# Altium schematic sheet current_channel.SchDoc: Current Channel
size A3; DrawnBy: Stefan Lippuner; Organization: TIK; DocumentNumber: 5; Revision: 1.1; SheetNumber: 5; SheetTotal: 8; PageSetup: Record=PageOptions|CenterHorizontal=True|CenterVertical=True|PrintScale=1.00|XCorrection=1.00|YCorrection=1.00|PrintKind=1|BorderSize=5000000|LeftOffset=0|BottomOffset=0|Orientation=2|PaperLength=1000|PaperWidth=1000|Scale=100|PaperSource=7|PrintQuality=-3|MediaType=1|DitherType=10|PrintScaleMode=1|PaperKind=A3|PaperIndex=8
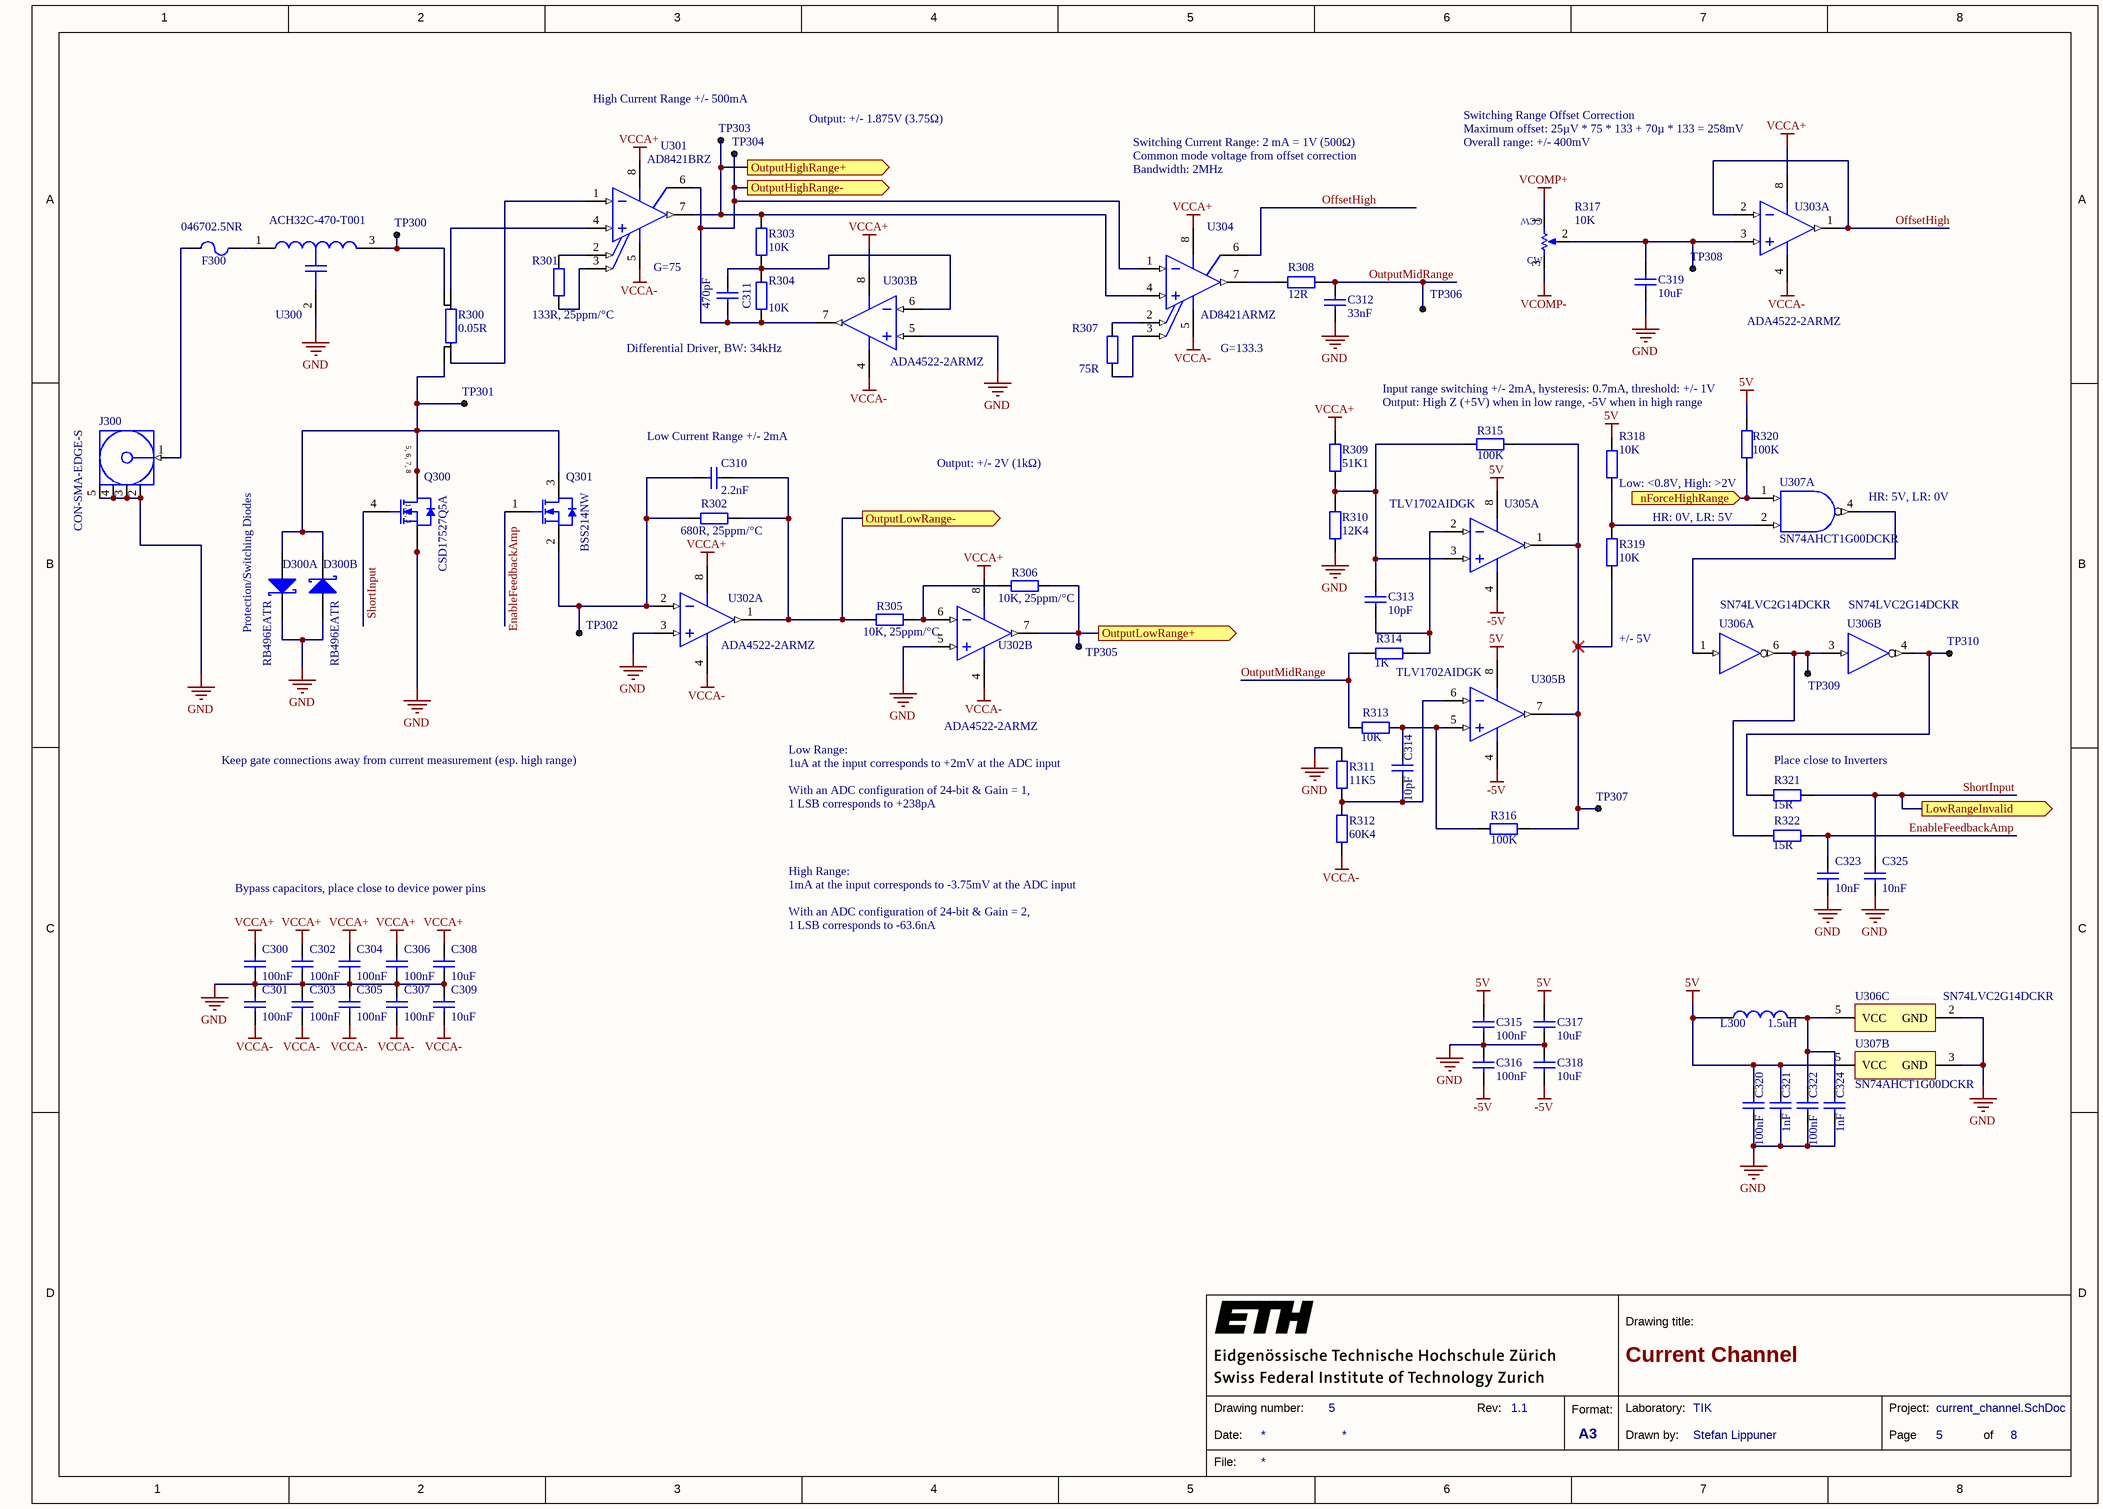
[diagram p0: current_channel.SchDoc]

## Parts
(Parts that share a designator on the sheet are numbered #1, #2 ... from top to bottom, then left to right.)
C300  100nF  [CAPC0402(1005)60_L]
C301  100nF  [CAPC0402(1005)60_L]
C302  100nF  [CAPC0402(1005)60_L]
C303  100nF  [CAPC0402(1005)60_L]
C304  100nF  [CAPC0402(1005)60_L]
C305  100nF  [CAPC0402(1005)60_L]
C306  100nF  [CAPC0402(1005)60_L]
C307  100nF  [CAPC0402(1005)60_L]
C308  10uF  [CAPC0603(1608)100_L]
C309  10uF  [CAPC0603(1608)100_L]
C310  2.2nF  [CAPC0402(1005)60_L]
C311  470pF  [CAPC0402(1005)60_L]
C312  33nF  [CAPC0402(1005)60_L]
C313  10pF  [CAPC0402(1005)60_L]
C314  10pF  [CAPC0402(1005)60_L]
C315  100nF  [CAPC0402(1005)60_L]
C316  100nF  [CAPC0402(1005)60_L]
C317  10uF  [CAPC0603(1608)100_L]
C318  10uF  [CAPC0603(1608)100_L]
C319  10uF  [CAPC0603(1608)100_L]
C320  100nF  [CAPC0402(1005)60_L]
C321  1nF  [CAPC0402(1005)60_L]
C322  100nF  [CAPC0402(1005)60_L]
C323  10nF  [CAPC0402(1005)60_L]
C324  1nF  [CAPC0402(1005)60_L]
C325  10nF  [CAPC0402(1005)60_L]
D300  RB496EATR  [Z5+1_L]  (parts A,B of 2)
F300  046702.5NR  [RESC0603(1608)_L]
J300  CON-SMA-EDGE-S  [132322]
L300  1.5uH  [INDC0603(1608)_L]
Q300  CSD17527Q5A  [PowerPAK_SO-8_V]
Q301  BSS214NW  [INF-PG-SOT-323_L]
R300  value 0.05R  [WSK1206]  (hidden comment: WSK1206R0500FEA)
R301  133R, 25ppm/°C  [RESC0402(1005)_L]
R302  680R, 25ppm/°C  [RESC0402(1005)_L]
R303  10K  [RESC0402(1005)_L]
R304  10K  [RESC0402(1005)_L]
R305  10K, 25ppm/°C  [RESC0402(1005)_L]
R306  10K, 25ppm/°C  [RESC0402(1005)_L]
R307  75R  [RESC0402(1005)_L]
R308  12R  [RESC0402(1005)_L]
R309  51K1  [RESC0402(1005)_L]
R310  12K4  [RESC0402(1005)_L]
R311  11K5  [RESC0402(1005)_L]
R312  60K4  [RESC0402(1005)_L]
R313  10K  [RESC0402(1005)_L]
R314  1K  [RESC0402(1005)_L]
R315  100K  [RESC0402(1005)_L]
R316  100K  [RESC0402(1005)_L]
R317  value 10K  [43W]  (hidden comment: 43WR10KLFTR)
R318  10K  [RESC0402(1005)_L]
R319  10K  [RESC0402(1005)_L]
R320  100K  [RESC0402(1005)_L]
R321  15R  [RESC0402(1005)_L]
R322  15R  [RESC0402(1005)_L]
TP300  (no value)  [Pad-0.6mm]  (no BOM)
TP301  (no value)  [Pad-0.6mm]  (no BOM)
TP302  (no value)  [Pad-0.6mm]  (no BOM)
TP303  (no value)  [Pad-0.6mm]  (no BOM)
TP304  (no value)  [Pad-0.6mm]  (no BOM)
TP305  (no value)  [Pad-0.6mm]  (no BOM)
TP306  (no value)  [Pad-0.6mm]  (no BOM)
TP307  (no value)  [Pad-0.6mm]  (no BOM)
TP308  (no value)  [Pad-0.6mm]  (no BOM)
TP309  (no value)  [Pad-0.6mm]  (no BOM)
TP310  (no value)  [Pad-0.6mm]  (no BOM)
U300  ACH32C-470-T001  [ACH32C]
U301  AD8421BRZ  [M08A_L]
U302#1  ADA4522-2ARMZ  [ADI-RM-8_L]  (part A of 2)
U302#2  ADA4522-2ARMZ  [ADI-RM-8_L]  (part B of 2)
U303  ADA4522-2ARMZ  [ADI-RM-8_L]  (parts A,B of 2)
U304  AD8421ARMZ  [ADI-RM-8_L]
U305  TLV1702AIDGK  [ADI-RM-8_L]  (parts A,B of 2)
U306  SN74LVC2G14DCKR  [DCK0006A_L]  (parts A,B,C of 3)
U307  SN74AHCT1G00DCKR  [DCK0005A_L]  (parts A,B of 2)

## Ports
LowRangeInvalid (out), nForceHighRange (in), OutputHighRange+ (out), OutputHighRange- (out), OutputLowRange+ (out), OutputLowRange- (out)

## Nets
5V: C315.2 C317.2 C320.2 C321.2 L300.1 R318.2 R320.2 U305.8(V+) U307.5(VCC)
-5V: C316.1 C318.1 U305.4(V-)
GND: C300.1 C301.2 C302.1 C303.2 C304.1 C305.2 C306.1 C307.2 C308.1 C309.2 C312.1 C315.1 C316.2 C317.1 C318.2 C319.1 C320.1 C321.1 C322.1 C323.1 C324.1 C325.1 D300.3(A) D300.5(K) J300.2(GND) J300.3(GND) J300.4(GND) J300.5(GND) Q300.1(S) Q300.2(S) Q300.3(S) R310.1 R311.2 U300.2 U302#1.3(1IN+) U302#2.5(2IN+) U303.5(2IN+) U306.2(GND) U307.3(GND)
VCCA+: C300.2 C302.2 C304.2 C306.2 C308.2 R309.2 U301.8(+VS) U302#1.8(V+) U302#2.8(V+) U303.8(V+) U304.8(+VS)
VCCA-: C301.1 C303.1 C305.1 C307.1 C309.1 R312.1 U301.5(-VS) U302#1.4(V-) U302#2.4(V-) U303.4(V-) U304.5(-VS)
VCOMP+: R317.1(CCW)
VCOMP-: R317.3(CW)
EnableFeedbackAmp: C323.2 Q301.1(GATE) R322.1
nForceHighRange: R320.1 U307.1(A) ; port nForceHighRange
OffsetHigh: U303.1(1OUT) U303.2(1IN-) U304.6(REF)
OutputHighRange+: R303.2 TP303.1 U301.7(VOUT) U304.4(+IN) ; port OutputHighRange+
OutputHighRange-: C311.1 R304.1 TP304.1 U301.6(REF) U303.7(2OUT) U304.1(-IN) ; port OutputHighRange-
OutputLowRange+: R306.1 TP305.1 U302#2.7(2OUT) ; port OutputLowRange+
OutputLowRange-: C310.2 R302.1 R305.2 U302#1.1(1OUT) ; port OutputLowRange-
OutputMidRange: C312.2 R308.2 R313.2 R314.1 TP306.1
ShortInput: C325.2 Q300.4(G) R321.1 ; port LowRangeInvalid
NetC310_1: C310.1 Q301.2(SOURCE) R302.2 TP302.1 U302#1.2(1IN-)
NetC311_2: C311.2 R303.1 R304.2 U303.6(2IN-)
NetC313_1: C313.1 R309.1 R310.2 R315.1 U305.3(1IN+)
NetC313_2: C313.2 R314.2 U305.2(1IN-)
NetC314_1: C314.1 R313.1 R316.1 U305.5(2IN+)
NetC314_2: C314.2 R311.1 R312.2 U305.6(2IN-)
NetC319_2: C319.2 R317.2(WIPER) TP308.1 U303.3(1IN+)
NetC322_2: C322.2 C324.2 L300.2 U306.5(VCC)
NetD300_1: D300.1(A) D300.4(K) Q300.5(D) Q300.6(D) Q300.7(D) Q300.8(D) Q301.3(DRAIN) R300.3(SENSE_1) TP301.1
NetF300_1: F300.1 J300.1(Signal)
NetF300_2: F300.2 U300.1
NetR300_1: R300.1 U301.1(-IN)
NetR300_2: R300.2 U301.4(+IN)
NetR300_4: R300.4(SENSE_2) TP300.1 U300.3
NetR301_1: R301.1 U301.3(RG3)
NetR301_2: R301.2 U301.2(RG2)
NetR305_1: R305.1 R306.2 U302#2.6(2IN-)
NetR307_1: R307.1 U304.3(RG3)
NetR307_2: R307.2 U304.2(RG2)
NetR308_1: R308.1 U304.7(VOUT)
NetR315_2: R315.2 R316.2 R319.1 TP307.1 U305.1(1OUT) U305.7(2OUT)
NetR318_1: R318.1 R319.2 U307.2(B)
NetR321_2: R321.2 TP310.1 U306.4(2Y)
NetR322_2: R322.2 TP309.1 U306.3(2A) U306.6(1Y)
NetU306_1: U306.1(1A) U307.4(Y)

## Notes on the sheet
- High Current Range +/- 500mA
- Output: +/- 1.875V (3.75Ω)
- Switching Current Range: 2 mA = 1V (500Ω)
  Common mode voltage from offset correction
  Bandwidth: 2MHz
- (near U303) Switching Range Offset Correction
  Maximum offset: 25µV * 75 * 133 + 70µ * 133 = 258mV
  Overall range: +/- 400mV
- (near U301) G=75
- Differential Driver, BW: 34kHz
- (near U304) G=133.3
- (near C310) Low Current Range +/- 2mA
- Input range switching +/- 2mA, hysteresis: 0.7mA, threshold: +/- 1V
- Output: High Z (+5V) when in low range, -5V when in high range
- Output: +/- 2V (1kΩ)
- (near R318) Low: <0.8V, High: >2V
- (near U307) HR: 5V, LR: 0V
- HR: 0V, LR: 5V
- (near D300) Protection/Switching Diodes
- +/- 5V
- Keep gate connections away from current measurement (esp. high range)
- (near R321) Place close to Inverters
- Low Range:
  1uA at the input corresponds to +2mV at the ADC input
  With an ADC configuration of 24-bit & Gain = 1,
  1 LSB corresponds to +238pA
- Bypass capacitors, place close to device power pins
- High Range:
  1mA at the input corresponds to -3.75mV at the ADC input
  With an ADC configuration of 24-bit & Gain = 2,
  1 LSB corresponds to -63.6nA
- 1
- 2
- 3
- 4
- 5
- 6
- 7
- 8
- A
- B
- C
- D
- Drawing title:
- Date:
- Drawing number:
- Rev:
- Format:
- A3
- Drawn by:
- Laboratory:
- Page
- Project:
- of
- File:
- (in symbol CMP-00221-1) 5, 6, 7, 8; 1, 2, 3

## Library data of the parts
C300-C307 C315 C316 C320 C322 = CMP-1034-02071-1: CAP 100nF 16V -20% to +80% 0402 (1005 Metric) Thickness 0.6mm SMD; Case-Metric: 1005; Case-EIA: 0402; Value: 100nF; Rated Voltage: 16 V; Tolerance: -20% to +80%; Technology: SMT; Max Thickness: 0.6 mm
C308 C309 C317-C319 = CMP-1035-02800-1: CAP 10uF 10V ±20% 0603 (1608 Metric) Thickness 1mm SMD; Tolerance: Â±20%; Case-EIA: 0603; Case-Metric: 1608; Max Thickness: 1 mm; Rated Voltage: 10 V; Technology: SMT; Value: 10uF
C310 = CMP-1034-01741-1: CAP 2.2nF 50V ±5% 0402 (1005 Metric) Thickness 0.6mm SMD; Case-EIA: 0402; Tolerance: Â±5%; Case-Metric: 1005; Technology: SMT; Value: 2.2nF; Max Thickness: 0.6 mm; Rated Voltage: 50 V
C311 = CMP-1034-01500-1: CAP 470pF 50V ±5% 0402 (1005 Metric) Thickness 0.6mm SMD; Case-Metric: 1005; Case-EIA: 0402; Tolerance: Â±5%; Max Thickness: 0.6 mm; Technology: SMT; Value: 470pF; Rated Voltage: 50 V
C312 = CMP-1590-00004-1: CAP 33nF 16V ±5%, 0402 (1005 Metric) Chip Capacitor; Case-EIA: 0402; Value: 30nF; Case-Metric: 1005; PackageReference: CAPC0402(1005)60; Supplier 1: Digi-Key; Supplier Part Number 1: 399-8964-6-ND
C313 C314 = CMP-1034-00724-1: CAP 10pF 50V ±5% 0402 (1005 Metric) Thickness 0.6mm SMD; Tolerance: Â±5%; Case-EIA: 0402; Case-Metric: 1005; Technology: SMT; Rated Voltage: 50 V; Value: 10pF; Max Thickness: 0.6 mm
C321 C324 = CMP-1034-01626-1: CAP 1nF 50V ±5% 0402 (1005 Metric) Thickness 0.6mm SMD; Case-EIA: 0402; Tolerance: Â±5%; Case-Metric: 1005; Rated Voltage: 50 V; Value: 1nF; Technology: SMT; Max Thickness: 0.6 mm
C323 C325 = CMP-1034-01879-1: CAP 10nF 25V ±5% 0402 (1005 Metric) Thickness 0.6mm SMD; Tolerance: Â±5%; Case-EIA: 0402; Case-Metric: 1005; Value: 10nF; Technology: SMT; Max Thickness: 0.6 mm; Rated Voltage: 25 V
D300 = CMP-00093-1: DIODE ARRAY SCHOTTKY 20V TSMD5; Manufacturer: Rohm Semiconductor; Diode Configuration: 2 Independent; Current - Average Rectified (Io) (per Diode): 1A; Voltage - Forward (Vf) (Max) @ If: 400mV @ 1A; Speed: Fast Recovery =< 500ns, > 200mA (Io); Current - Reverse Leakage @ Vr: 500µA @ 10V; Packaging: Digi-Reel®; Diode Type: Schottky; Voltage - DC Reverse (Vr) (Max): 20V; Mounting Type: Surface Mount; Package / Case: SOT-23-5 Thin, TSOT-23-5; Supplier Device Package: TSMD5; P/N: RB496EATR; Supplier: Digi-Key; Supplier Part Number: RB496EADKR-ND; ComponentLink1Description: rb496ea.pdf; ComponentLink1URL: http://rohmfs.rohm.com/en/products/databook/datasheet/discrete/diode/schottky_barrier/rb496ea.pdf
F300 = CMP-00099-1: Fuse Chip Very Fast Acting 2.5A 32V SMD Solder Pad 0603; Manufacturer: Littelfuse Inc.; Fuse Type: Board Mount (Cartridge Style Excluded); Breaking Capacity @ Rated Voltage: 35A; Melting I²t: 0.2066; Approvals: CSA, UL; DC Cold Resistance: 0.021 Ohm; Packaging: Tape & Reel (TR); Current Rating: 2.5A; Voltage Rating - AC: 32V; Voltage Rating - DC: 32V; Response Time: Fast; Package / Case: 0603 (1608 Metric); Mounting Type: Surface Mount; Operating Temperature: -55°C ~ 90°C; Color: -; Size / Dimension: 0.063" L x 0.032" W x 0.012" H (1.60mm x 0.81mm x 0.31mm); P/N: 046702.5NR; Supplier: Digi-Key; Supplier Part Number: F1398TR-ND; ComponentLink1Description: littelfuse_fuse_467_datasheet.pdf.pdf; ComponentLink1URL: http://www.littelfuse.com/~/media/electronics/datasheets/fuses/littelfuse_fuse_467_datasheet.pdf.pdf
J300 = CMP-00231-1: SMA FEMALE PCB EDGE MOUNT; Manufacturer: RF Solutions; Connector Type: Jack, Female Socket; Contact Termination: Solder; Packaging: -; Part Status: Active; Connector Style: SMA; Shield Termination: Solder; Impedance: -; Mounting Type: Board Edge, End Launch; Cable Group: -; Fastening Type: Threaded; Frequency - Max: -; Features: -; Housing Color: -; Ingress Protection: -; Body Material: -; Body Finish: -; Center Contact Material: -; Center Contact Plating: -; Dielectric Material: -; Voltage Rating: -; Operating Temperature: -; Manufacturer Part Number: CON-SMA-EDGE-S; Supplier: Digi-Key; Supplier Part Number: CON-SMA-EDGE-S-ND
L300 = CMP-00229-1: FIXED IND 1.5UH 50MA 700 MOHM; Manufacturer: TDK Corporation; Manufacturer Part Number: MLF1608A1R5M; Type: Multilayer; Material - Core: Ferrite; Inductance: 1.5µH; Tolerance: ±20%; Shielding: Shielded; DC Resistance (DCR): 700 mOhm Max; Q @ Freq: 35 @ 10MHz; Frequency - Self Resonant: 100MHz; Frequency - Test: 10MHz; Packaging: Cut Tape (CT); Part Status: Active; Current Rating: 50mA; Current - Saturation: -; Ratings: -; Operating Temperature: -40°C ~ 85°C; Mounting Type: Surface Mount; Package / Case: 0603 (1608 Metric); Size / Dimension: 0.063" L x 0.031" W (1.60mm x 0.80mm); Height - Seated (Max): 0.037" (0.95mm); Supplier: Digi-Key; Supplier Part Number: 445-6221-1-ND; ComponentLink1Description: inductor_commercial_standard_mlf1608_en.pdf; ComponentLink1URL: https://product.tdk.com/info/en/catalog/datasheets/inductor_commercial_standard_mlf1608_en.pdf
Q300 = CMP-00221-1: MOSFET N-CH 30V 65A 8SON; Manufacturer: Texas Instruments; FET Type: MOSFET N-Channel, Metal Oxide; FET Feature: Standard; Current - Continuous Drain (Id) @ 25°C: 65A (Tc); Rds On (Max) @ Id, Vgs: 10.8 mOhm @ 11A, 10V; Vgs(th) (Max) @ Id: 2V @ 250µA; Gate Charge (Qg) @ Vgs: 3.4nC @ 4.5V; Input Capacitance (Ciss) @ Vds: 506pF @ 15V; Power - Max: 3W; Packaging: Cut Tape (CT); Part Status: Active; Drain to Source Voltage (Vdss): 30V; Operating Temperature: -55°C ~ 150°C (TJ); Mounting Type: Surface Mount; Package / Case: 8-PowerTDFN; Supplier Device Package: 8-VSON (5x6); Manufacturer Part Number: CSD17527Q5A; Supplier: Digi-Key; Supplier Part Number: 296-29021-1-ND; ComponentLink1Description: csd17527q5a.pdf; ComponentLink1URL: http://www.ti.com/lit/ds/symlink/csd17527q5a.pdf
Q301 = CMP-1149-00041-1: N-Channel OptiMOS 2 Small-Signal-Transistor, 20 V VDS, 1.5 A ID, -55 to 150 degC, PG-SOT-323, Reel, Green; Manufacturer: Infineon; VDS (max): 20 V; VGS(th) (max): 1.2Â V; RthJA (max): 250 K/W; QG: 0.8Â nC; RDS (on) (max) (@4.5V): 140 mOhm; VGS(th) (min): 0.7Â V; IDpuls (max): 6 A; ID (max): 1.5Â A; Ptot (max): 0.5Â W; RDS (on) (max): 250 mOhm; Green: TRUE; PackageDescription: 3-Pin Small Outline Transistor Package, 2 x 1.25 mm Body, 0.65 mm Pitch; ComponentLink3URL: http://www.infineon.com/dgdl/SOT323-Package_Overview.pdf?folderId=db3a30431936bc4b0119533e1dcb3c92&fileId=db3a30431936bc4b011953495f283cb1; DatasheetVersion: Rev. 2.2; Mounting Technology: Surface Mount; ComponentLink2URL: http://www.infineon.com/dgdl/BSS214NW_Rev2.2.pdf?folderId=db3a3043156fd573011622e10b5c1f67&fileId=db3a30431b3e89eb011b695aebc01bde; PackageVersion: Apr-08; Halogen-free: TRUE; Packing: Reel; ComponentLink3Description: Package Specification; PartNumber: BSS214NW; ComponentLink2Description: Datasheet; PackageReference: PG-SOT-323; ComponentLink1URL: http://www.infineon.com/; RDS (on) (max) (@2.5V): 250 mOhm; ComponentLink1Description: Manufacturer URL
R300 = CMP-00094-1: RES SMD 0.05 OHM 1% 1/4W 1206; Manufacturer: Vishay Dale; Resistance (Ohms): 0.05; Power (Watts): 0.25W, 1/4W; Temperature Coefficient: ±35ppm/°C; Packaging: Cut Tape (CT); Tolerance: ±1%; Composition: Metal Element; Features: Current Sense, Moisture Resistant, Pulse Withstanding; Operating Temperature: -65°C ~ 170°C; Package / Case: 1206 (3216 Metric), Concave; Supplier Device Package: 1206; Size / Dimension: 0.126" L x 0.063" W (3.20mm x 1.60mm); Height: 0.035" (0.89mm); Number of Terminations: 2; Manufacturer Part Number: WSK1206R0500FEA; Supplier: Digi-Key; Supplier Part Number: 541-2707-1-ND; ComponentLink1Description: wsk1206.pdf; ComponentLink1URL: http://www.vishay.com/docs/30195/wsk1206.pdf
R301 = CMP-1591-00004-1: 133R, 25ppm/°C, 0402 (1005 Metric) Chip Resistor; Case-Metric: 1005; Case-EIA: 0402; PackageReference: RESC0402(1005); Supplier 1: Digi-Key; Supplier Part Number 1: A102612DKR-ND
R302 = CMP-1591-00004-1: 680R, 25ppm/°C 0402 (1005 Metric) Chip Resistor; Case-EIA: 0402; Case-Metric: 1005; PackageReference: RESC0402(1005); Supplier 1: Digi-Key; Supplier Part Number 1: RR05P680DCT-ND
R303 R304 R313 R318 R319 = CMP-1011-00623-1: 10K 0.063W 1% 0402 (1005 Metric)  SMD; Case-Metric: 1005; Value: 10000.00 Ohm; Case-EIA: 0402; Tolerance: 1 %; Technology: SMT; Power: 0.063 W
R305 R306 = CMP-1591-00004-1: 10K, 25ppm/°C 0402 (1005 Metric) Chip Resistor; Case-Metric: 1005; Case-EIA: 0402; PackageReference: RESC0402(1005); Supplier 1: Digi-Key; Supplier Part Number 1: RR05P10.0KDDKR-ND
R307 = CMP-1011-00383-1: 75R 0.063W 1% 0402 (1005 Metric)  SMD; Case-Metric: 1005; Case-EIA: 0402; Value: 75.00 Ohm; Power: 0.063 W; Tolerance: 1 %; Technology: SMT
R308 = CMP-1011-00001-1: 12R 0.063W 1% 0402 (1005 Metric)  SMD; Tolerance: None; Case-Metric: 1005; Case-EIA: 0402; Power: None; Value: 12R; Technology: SMT; Supplier 1: Digi-Key; Supplier Part Number 1: YAG2968DKR-ND
R309 = CMP-1011-00704-1: 51K1 0.063W 1% 0402 (1005 Metric)  SMD; Case-EIA: 0402; Case-Metric: 1005; Value: 51100.00 Ohm; Power: 0.063 W; Tolerance: 1 %; Technology: SMT
R310 = CMP-1011-00633-1: 12K4 0.063W 1% 0402 (1005 Metric)  SMD; Value: 12400.00 Ohm; Case-Metric: 1005; Case-EIA: 0402; Tolerance: 1 %; Power: 0.063 W; Technology: SMT
R311 = CMP-1011-00629-1: 11K5 0.063W 1% 0402 (1005 Metric)  SMD; Case-EIA: 0402; Case-Metric: 1005; Value: 11500.00 Ohm; Power: 0.063 W; Technology: SMT; Tolerance: 1 %
R312 = CMP-1011-00711-1: 60K4 0.063W 1% 0402 (1005 Metric)  SMD; Case-EIA: 0402; Case-Metric: 1005; Value: 60400.00 Ohm; Technology: SMT; Tolerance: 1 %; Power: 0.063 W
R314 = CMP-1011-00510-1: 1K 0.063W 1% 0402 (1005 Metric)  SMD; Case-EIA: 0402; Value: 1000.00 Ohm; Case-Metric: 1005; Technology: SMT; Tolerance: 1 %; Power: 0.063 W
R315 R316 R320 = CMP-1011-00736-1: 100K 0.063W 1% 0402 (1005 Metric)  SMD; Case-Metric: 1005; Value: 100000.00 Ohm; Case-EIA: 0402; Tolerance: 1 %; Technology: SMT; Power: 0.063 W
R317 = CMP-00121-2: TRIMMER 10K OHM 0.125W SMD; Manufacturer: TT Electronics/BI; Power (Watts): 0.125W, 1/8W; Tolerance: ±20%; Temperature Coefficient: ±100ppm/°C; Number of Turns: 11; Adjustment Type: Top Adjustment; Resistive Material: Cermet; Packaging: Tape & Reel (TR); Resistance (Ohms): 10k; Mounting Type: Surface Mount; Termination Style: J Lead; Size / Dimension: Rectangular - 0.161" x 0.125" Face x 0.161" H (4.10mm x 3.18mm x 4.10mm); P/N: 43WR10KLFTR; Supplier: Digi-Key; Supplier Part Number: 987-1030-2-ND; ComponentLink1Description: 43.pdf; ComponentLink1URL: http://www.bitechnologies.com/pdfs/43.pdf
R321 R322 = CMP-1011-00302-1: 15R 0.063W 1% 0402 (1005 Metric)  SMD; Case-Metric: 1005; Case-EIA: 0402; Value: 15.00 Ohm; Tolerance: 1 %; Power: 0.063 W; Technology: SMT
TP300-TP310 = CMP-00224-1: 0.6mm SMT Test Pad; Mounting Technology: SMT
U300 = CMP-00228-1: LC (T-Type) EMI Filter 3rd Order Low Pass 1 Channel C = 47pF 6A 1206 (3216 Metric), 3 PC Pad; Manufacturer: TDK Corporation; Number of Channels: 1; Attenuation Value: -15dB @ 650MHz ~ 2.5GHz; Resistance - Channel (Ohms): 0.002; Values: C = 47pF; ESD Protection: No; Voltage - Rated: 50V; Packaging: Tape & Reel (TR); Part Status: Active; Type: Low Pass; Filter Order: 3rd; Technology: LC (T-Type); Center / Cutoff Frequency: -; Current: 6A; Operating Temperature: -40°C ~ 125°C; Applications: General Purpose; Mounting Type: Surface Mount; Package / Case: 1206 (3216 Metric), 3 PC Pad; Size / Dimension: 0.126" L x 0.063" W (3.20mm x 1.60mm); Height: 0.091" (2.30mm); Manufacturer Part Number: ACH32C-470-T001; Supplier: Digi-Key; Supplier Part Number: 445-2991-2-ND; ComponentLink1Description: 3tf_commercial_power_ach32c_en.pdf; ComponentLink1URL: https://product.tdk.com/info/en/catalog/datasheets/3tf_commercial_power_ach32c_en.pdf
U301 = CMP-00086-1: Instrumentation Amplifier 3nV/Hz Low Power; Manufacturer: Analog Devices Inc.; Brand: Analog Devices; Number of Channels: 1 Channel; CMRR - Common Mode Rejection Ratio: 140 dB; Gain V/V: 1 V/V to 10000 V/V; Ib - Input Bias Current: 6 nA; Maximum Input Resistance: 30 GOhms at +/- 15 V; Operating Supply Current: 2 mA; PSRR - Power Supply Rejection Ratio: 150 dB; SR - Slew Rate: 35 V/us; Supply Voltage - Max: 36 V; Supply Voltage - Min: 5 V; Vcm - Common Mode Voltage: 5 V to 36 V; Voltage Gain dB: 80 dB; Vos - Input Offset Voltage: 25 uV; Amplifier Type: Instrumentation Amplifier; Package / Case: SOIC-8; Packaging: Tube; Product: Operational Amplifiers; Series: AD8421; Mounting Style: SMD/SMT; Maximum Operating Temperature: + 85 C; Minimum Operating Temperature: - 40 C; Standard Pack Qty: 98; RoHS - Mouser: Y; Minimum Order Quantity: 1; Reeling: False; P/N: AD8421BRZ; Supplier: Mouser; Supplier Part Number: 584-AD8421BRZ; ComponentLink1Description: AD8421-249267.pdf; ComponentLink1URL: http://www.mouser.com/ds/2/609/AD8421-249267.pdf
U302#1 U302#2 U303 = CMP-00103-1: SP Amp Zero Drift Amplifier Dual R-R I/O ±27.5V/55V 8-Pin MSOP; Manufacturer: Analog Devices Inc.; Amplifier Type: Zero-Drift; Output Type: Rail-to-Rail; Slew Rate: 1.7 V/µs; Gain Bandwidth Product: 2.7MHz; Current - Input Bias: 50pA; Voltage - Input Offset: 1.5µV; Current - Supply: 830µA; Current - Output / Channel: 32mA; Voltage - Supply, Single/Dual (±): 4.5 V ~ 55 V, ±2.25 V ~ 27.5 V; Packaging: Tube; Number of Circuits: -; -3db Bandwidth: -; Operating Temperature: -40°C ~ 125°C; Mounting Type: Surface Mount; Package / Case: 8-TSSOP, 8-MSOP (0.118", 3.00mm Width); Supplier Device Package: 8-MSOP; Manufacturer Part Number: ADA4522-2ARMZ; Supplier: Digi-Key; Supplier Part Number: ADA4522-2ARMZ-ND; ComponentLink1Description: ADA4522-1_4522-2_4522-4.pdf; ComponentLink1URL: http://www.analog.com/media/en/technical-documentation/data-sheets/ADA4522-1_4522-2_4522-4.pdf
U304 = CMP-00122-1: Instrument Amplifier, 1, 60 V, 35 V/ s, 10 MHz, 5V to 36V, MSOP; Manufacturer: Analog Devices Inc.; Amplifier Type: Instrumentation; Number of Circuits: 1; Slew Rate: 35 V/µs; -3db Bandwidth: 10MHz; Current - Input Bias: 1nA; Voltage - Input Offset: 60µV; Current - Supply: 2mA; Current - Output / Channel: 65mA; Voltage - Supply, Single/Dual (±): 5 V ~ 36 V, ±2.5 V ~ 18 V; Packaging: Tube; Output Type: -; Gain Bandwidth Product: -; Operating Temperature: -40°C ~ 85°C; Mounting Type: Surface Mount; Package / Case: 8-TSSOP, 8-MSOP (0.118", 3.00mm Width); Supplier Device Package: 8-MSOP; P/N: AD8421ARMZ; Supplier: Digi-Key; Supplier Part Number: AD8421ARMZ-ND; ComponentLink1Description: AD8421.pdf; ComponentLink1URL: http://www.analog.com/media/en/technical-documentation/data-sheets/AD8421.pdf
U305 = CMP-00089-1: Analog Comparators Dual 2.2V to 36V microPwr Comparator; Input Type: Rail to Rail; Output Type: Open Collector; Response Time: 780 ns; Brand: Texas Instruments; Comparator Type: General Purpose; Number of Channels: 2 Channel; Ib - Input Bias Current: 15 nA; Operating Supply Current: 75 uA; PSRR - Power Supply Rejection Ratio: 20 uV/V; Vos - Input Offset Voltage: 2.5 mV; Package / Case: VSSOP-8; Packaging: Tube; Product: Analog Comparators; Series: TLV1702; Mounting Style: SMD/SMT; GBP - Gain Bandwidth Product: -; Manufacturer: Texas Instruments; Maximum Operating Temperature: + 125 C; Minimum Operating Temperature: - 40 C; Propagation Delay Time: 780 ns; Standard Pack Qty: 80; Supply Voltage - Max: 36 V; Supply Voltage - Min: 2.2 V; Vcm - Common Mode Voltage: 2.2 V to 36 V; RoHS - Mouser: Y; Minimum Order Quantity: 1; Reeling: False; P/N: TLV1702AIDGK; Supplier: Mouser; Supplier Part Number: 595-TLV1702AIDGK; ComponentLink1Description: tlv1702-556650.pdf; ComponentLink1URL: http://www.mouser.com/ds/2/405/tlv1702-556650.pdf; PartId: 1
U306 = CMP-0859-00454-3: Dual Schmitt-Trigger Inverter, DCK0006A, LARGE T&R; Manufacturer: Texas Instruments; 3-State Output: No; VCC(Min)(V): 1.65; Rating: Catalog; Sub-Family: Inverting Buffer/Driver; Voltage(Nom)(V): 1.8,2.5,3.3,5; Output Drive (IOL/IOH)(Max)(mA): 32/-32; tpd @ Nom Voltage(Max)(ns): 9.5,5.7,5.4,4.3; Schmitt Trigger: Yes; Technology Family: LVC; VCC(Max)(V): 5.5; Logic: Inverting; Output Type: CMOS; Input Type: CMOS/TTL; DatasheetVersion: SCES200M; Generic Part Number: SN74LVC2G14; Operating Temperature Range(C): -40 to 125; PackageReference: DCK0006A; PartId: 1
U307 = CMP-0859-00300-3: Single 2-Input Positive-NAND Gate, DCK0005A, LARGE T&R; Manufacturer: Texas Instruments; Rating: Catalog; Schmitt Trigger: No; Voltage(Nom)(V): 3.3,5; Output Type: CMOS; Logic: True; VCC(Min)(V): 2; tpd @ Nom Voltage(Max)(ns): 11.4,7.5; Technology Family: AHCT; VCC(Max)(V): 5.5; Output Drive (IOL/IOH)(Max)(mA): 50/-50; Gate Type: NAND; F @ Nom Voltage(Max)(Mhz): 75; ICC @ Nom Voltage(Max)(mA): 0.01; Bits(#): 1; Operating Temperature Range(C): -40 to 125; Sub-Family: NAND Gate; ComponentLink2Description: Datasheet; PackageReference: DCK0005A; ComponentLink1Description: Manufacturer URL; ComponentLink1URL: http://www.ti.com/; Part Number: SN74AHCT1G00; 3-State Output: No; DatasheetVersion: SCLS316N; Input Type: CMOS; PartNumber: SN74AHCT1G00DCKR; ComponentLink2URL: http://www.ti.com/lit/ds/symlink/sn74ahct1g00.pdf; PartId: 1; Generic Part Number: SN74AHCT1G00